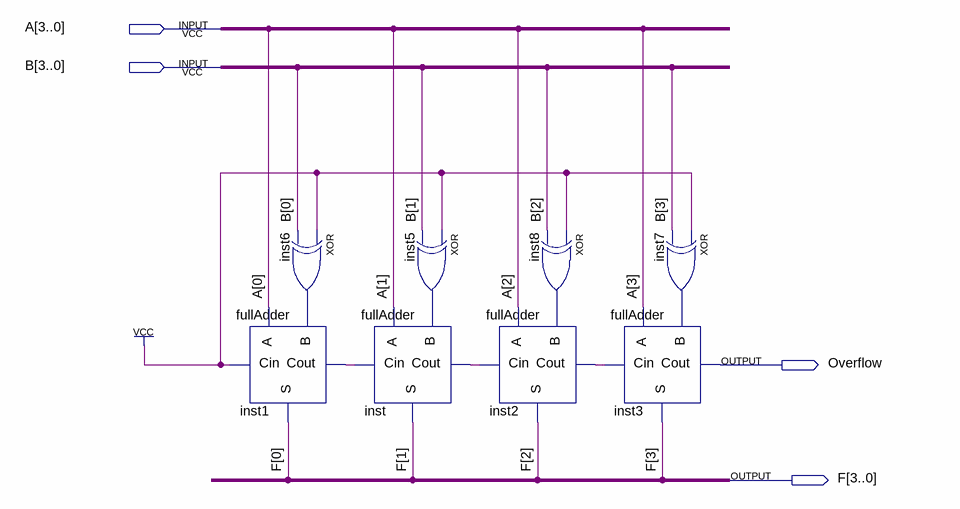
[diagram p0: schematic sheet]
// Quartus schematic Subtrator4Bits.bdf as structural Verilog: 8 symbols, 4 pins
module Subtrator4Bits (
  input  [3:0] A,
  input  [3:0] B,
  output Overflow,
  output [3:0] F
);

  wire inst1_cout, inst2_cout, inst5_out, inst6_out, inst7_out, inst8_out, inst_cout;

  fullAdder inst1 (.A(A[0]), .B(inst6_out), .Cin(1'b1), .S(F[0]), .Cout(inst1_cout));
  xor inst6 (inst6_out, 1'b1, B[0]);
  fullAdder inst (.A(A[1]), .B(inst5_out), .Cin(inst1_cout), .S(F[1]), .Cout(inst_cout));
  xor inst5 (inst5_out, 1'b1, B[1]);
  xor inst8 (inst8_out, 1'b1, B[2]);
  fullAdder inst2 (.A(A[2]), .B(inst8_out), .Cin(inst_cout), .S(F[2]), .Cout(inst2_cout));
  fullAdder inst3 (.A(A[3]), .B(inst7_out), .Cin(inst2_cout), .S(F[3]), .Cout(Overflow));
  xor inst7 (inst7_out, 1'b1, B[3]);
endmodule
